# Altium schematic sheet Z80PC.SchDoc: Простой компьютер на Z80
size 420 x 297 mm; Разраб.: Осипенко; Д: Петров; Утв.: Сидоров; Наименование организации: ОАО "Ваша фирма"; Перв. применение: АБВГ.123456.000; Наименование изделия 1: Плата; Наименование изделия 2: Схема электрическая; Наименование изделия 3: принципиальная; Нач. отд.: Нач. отд.; Фамилия нач. отд.: Сидоров; CheckedBy: Пашнев В.В.; Author: Осипенко Д.В.; CompanyName: ВТиЭ; Address1: Address1; Address2: Address2; Address3: Address3; Address4: Address4; DocumentNumber: ПЗ 090301506 03 ЭЗ; SheetNumber: 1; SheetTotal: 1; Scale: 1:1; DocumentType: Схема электрическая принципиальная; Обозначение документа: АБВГ.123456.001Э3
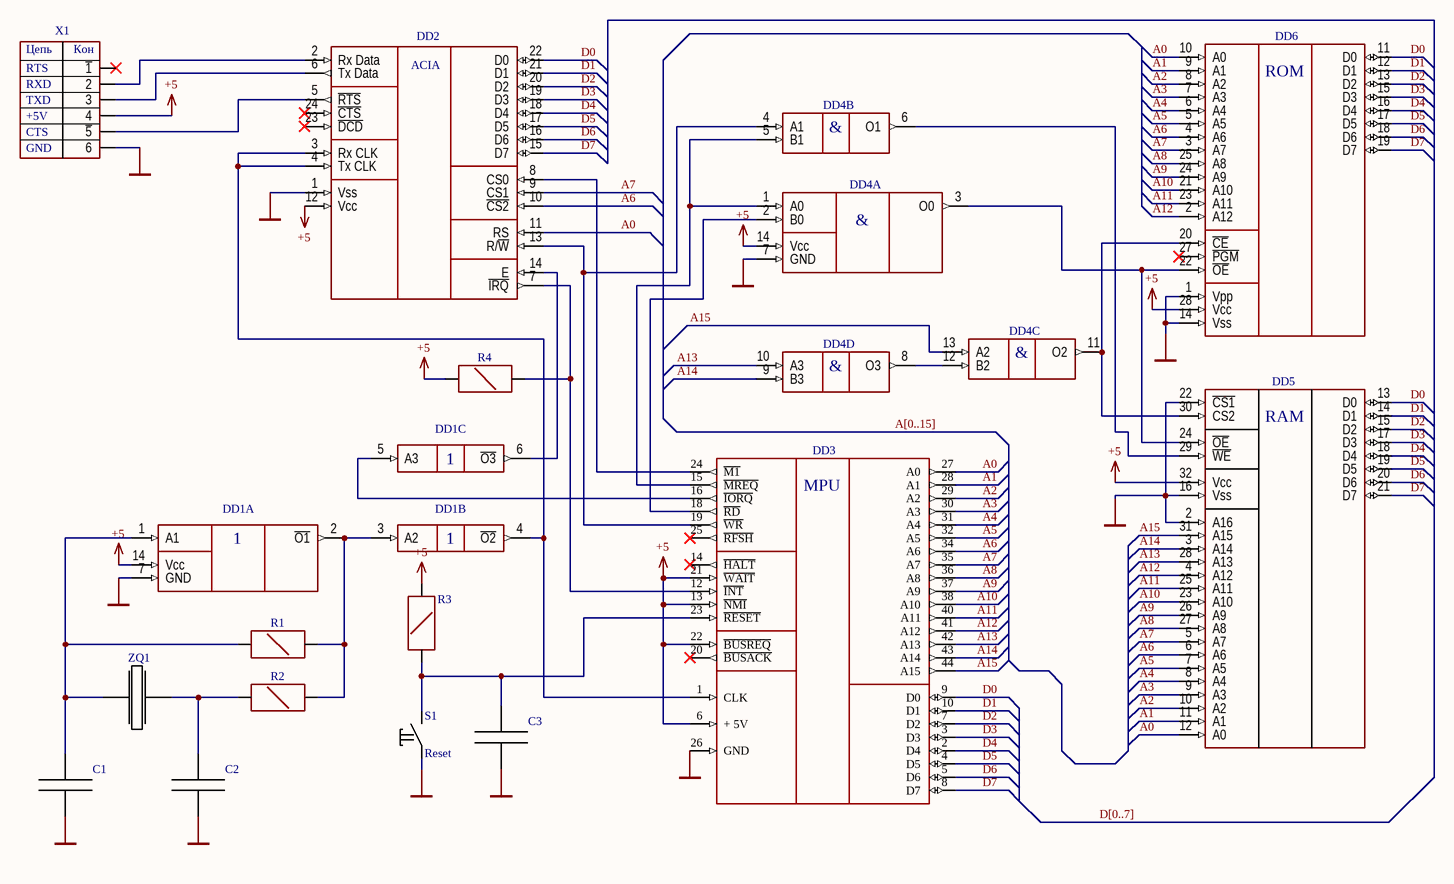
[diagram p0: Z80PC.SchDoc]

## Parts
C1  22p  [1206 Capacitor]  (value not drawn)
C2  22p  [1206 Capacitor]  (value not drawn)
C3  22p  [1206 Capacitor]  (value not drawn)
DD1  74HCT04  [N014]  (value not drawn)  (parts A,B,C of 6)
DD2  MC6850S  [DIP24]  (value not drawn)
DD3  Z84C0008AEG  [LQFP44]  (value not drawn)
DD4  74LCX32  [SOP14]  (value not drawn)  (parts A,B,C,D of 4)
DD5  HM628128D  [SOP32]  (value not drawn)
DD6  M2764A  [DIP28]  (value not drawn)
R1  1M  [1206 Resistor]  (value not drawn)
R2  1K  [1206 Resistor]  (value not drawn)
R3  2.2K  [1206 Resistor]  (value not drawn)
R4  3.3K  [1206 Resistor]  (value not drawn)
S1  Reset  [PLS-2]
X1  USB  [PLS-6]  (value not drawn)
ZQ1  7,3728-HC49SM  [HC-49S]  (value not drawn)

## Nets
+5: DD1.14(Vcc) DD2.12(Vcc) DD3.6(+_5V) DD3.13(~{NMI}) DD3.21(~{WAIT}) DD3.22(~{BUSREQ}) DD4.14(Vcc) DD5.32(Vcc) DD6.28(Vcc) R3.0 R4.0 X1.4
GND: C1.1 C2.1 C3.1 DD1.7(GND) DD2.1(Vss) DD3.26(GND) DD4.7(GND) DD5.2(A16) DD5.16(Vss) DD5.22(~{CS1}) DD6.1(Vpp) DD6.14(Vss) S1.1 X1.6
A0: DD2.11(RS) DD3.27(A0) DD5.12(A0) DD6.10(A0)
A1: DD3.28(A1) DD5.11(A1) DD6.9(A1)
A2: DD3.29(A2) DD5.10(A2) DD6.8(A2)
A3: DD3.30(A3) DD5.9(A3) DD6.7(A3)
A4: DD3.31(A4) DD5.8(A4) DD6.6(A4)
A5: DD3.32(A5) DD5.7(A5) DD6.5(A5)
A6: DD2.10(~{CS2}) DD3.34(A6) DD5.6(A6) DD6.4(A6)
A7: DD2.9(CS1) DD3.35(A7) DD5.5(A7) DD6.3(A7)
A8: DD3.36(A8) DD5.27(A8) DD6.25(A8)
A9: DD3.37(A9) DD5.26(A9) DD6.24(A9)
A10: DD3.38(A10) DD5.23(A10) DD6.21(A10)
A11: DD3.40(A11) DD5.25(A11) DD6.23(A11)
A12: DD3.41(A12) DD5.4(A12) DD6.2(A12)
A13: DD3.42(A13) DD4.10(A3) DD5.28(A13)
A14: DD3.43(A14) DD4.9(B3) DD5.3(A14)
A15: DD3.44(A15) DD4.13(A2) DD5.31(A15)
D0: DD2.22(D0) DD3.9(D0) DD5.13(D0) DD6.11(D0)
D1: DD2.21(D1) DD3.10(D1) DD5.14(D1) DD6.12(D1)
D2: DD2.20(D2) DD3.7(D2) DD5.15(D2) DD6.13(D2)
D3: DD2.19(D3) DD3.3(D3) DD5.17(D3) DD6.15(D3)
D4: DD2.18(D4) DD3.2(D4) DD5.18(D4) DD6.16(D4)
D5: DD2.17(D5) DD3.4(D5) DD5.19(D5) DD6.17(D5)
D6: DD2.16(D6) DD3.5(D6) DD5.20(D6) DD6.18(D6)
D7: DD2.15(D7) DD3.8(D7) DD5.21(D7) DD6.19(D7)
NetC1_2: C1.2 DD1.1(A1) R1.0 ZQ1.1
NetC2_2: C2.2 R2.1 ZQ1.2
NetC3_2: C3.2 DD3.23(~{RESET}) R3.1 S1.2
NetDD1_2: DD1.2(~{O1}) DD1.3(A2) R1.1 R2.0
NetDD1_4: DD1.4(~{O2}) DD2.3(Rx_CLK) DD2.4(Tx_CLK) DD3.1(CLK)
NetDD1_5: DD1.5(A3) DD3.16(~{IORQ})
NetDD1_6: DD1.6(~{O3}) DD2.14(E)
NetDD2_2: DD2.2(Rx_Data) X1.2
NetDD2_5: DD2.5(~{RTS}) X1.5(~{5})
NetDD2_6: DD2.6(Tx_Data) X1.3
NetDD2_7: DD2.7(~{IRQ}) DD3.12(~{INT}) R4.1
NetDD2_8: DD2.8(CS0) DD3.24(~{M1})
NetDD2_13: DD2.13(R/~{W}) DD3.19(~{WR}) DD4.4(A1)
NetDD3_15: DD3.15(~{MREQ}) DD4.1(A0) DD4.5(B1)
NetDD3_18: DD3.18(~{RD}) DD4.2(B0)
NetDD4_3: DD4.3(O0) DD5.24(~{OE}) DD6.22(~{OE})
NetDD4_6: DD4.6(O1) DD5.29(~{WE})
NetDD4_8: DD4.8(O3) DD4.12(B2)
NetDD4_11: DD4.11(O2) DD5.30(CS2) DD6.20(~{CE})

Not connected (* = marked no-connect by the designer): DD2 23(~{DCD})* 24(~{CTS})*; DD3 14(~{HALT})* 20(~{BUSACK})* 25(~{RFSH})*; DD6 27(~{PGM})*; X1 1(~{1})*

## Buses and harness runs
bus A[0..15]
bus D[0..7]

## Notes on the sheet
- Перв. примен.
- Справ. №
- Подп. и дата
- Инв. № дубл.
- Взам. инв. №
- Разраб.
- Изм.
- Лист
- № докум.
- Подп.
- Дата
- Лит.
- Масса
- Масштаб
- Пров.
- Т.контр.
- Листов
- Инв. № подл.
- Утв.
- Н.контр.
- 2.106-A3
- Копировал
- Формат А3
- (in symbol 74LCX32, part A) &
- (in symbol 74LCX32, part B) &
- (in symbol 74LCX32, part C) &
- (in symbol 74LCX32, part D) &
- (in symbol M2764A) ROM
- (in symbol USB) Цепь; Кон; RTS; RXD; TXD; +5V; CTS; GND
- (in symbol Z84C0008AEG) MPU

## Library data of the parts
C1-C3 = Capacitor
DD1 = 74HCT04: 6x not gate
DD2 = MC6850S: ACIA
DD3 = Z84C0008AEG: Z80 CPU, 8Mhz
DD4 = 74LCX32: 4x 2-or gates
DD5 = HM628128D: RAM
DD6 = M2764A: eprom
R1-R4 = Resistor: 5%, 0.5W
S1 = btn
ZQ1 = 7,3728-HC49SM: Резонатор